# EAGLE schematic system-controller (EAGLE 7.6.0)
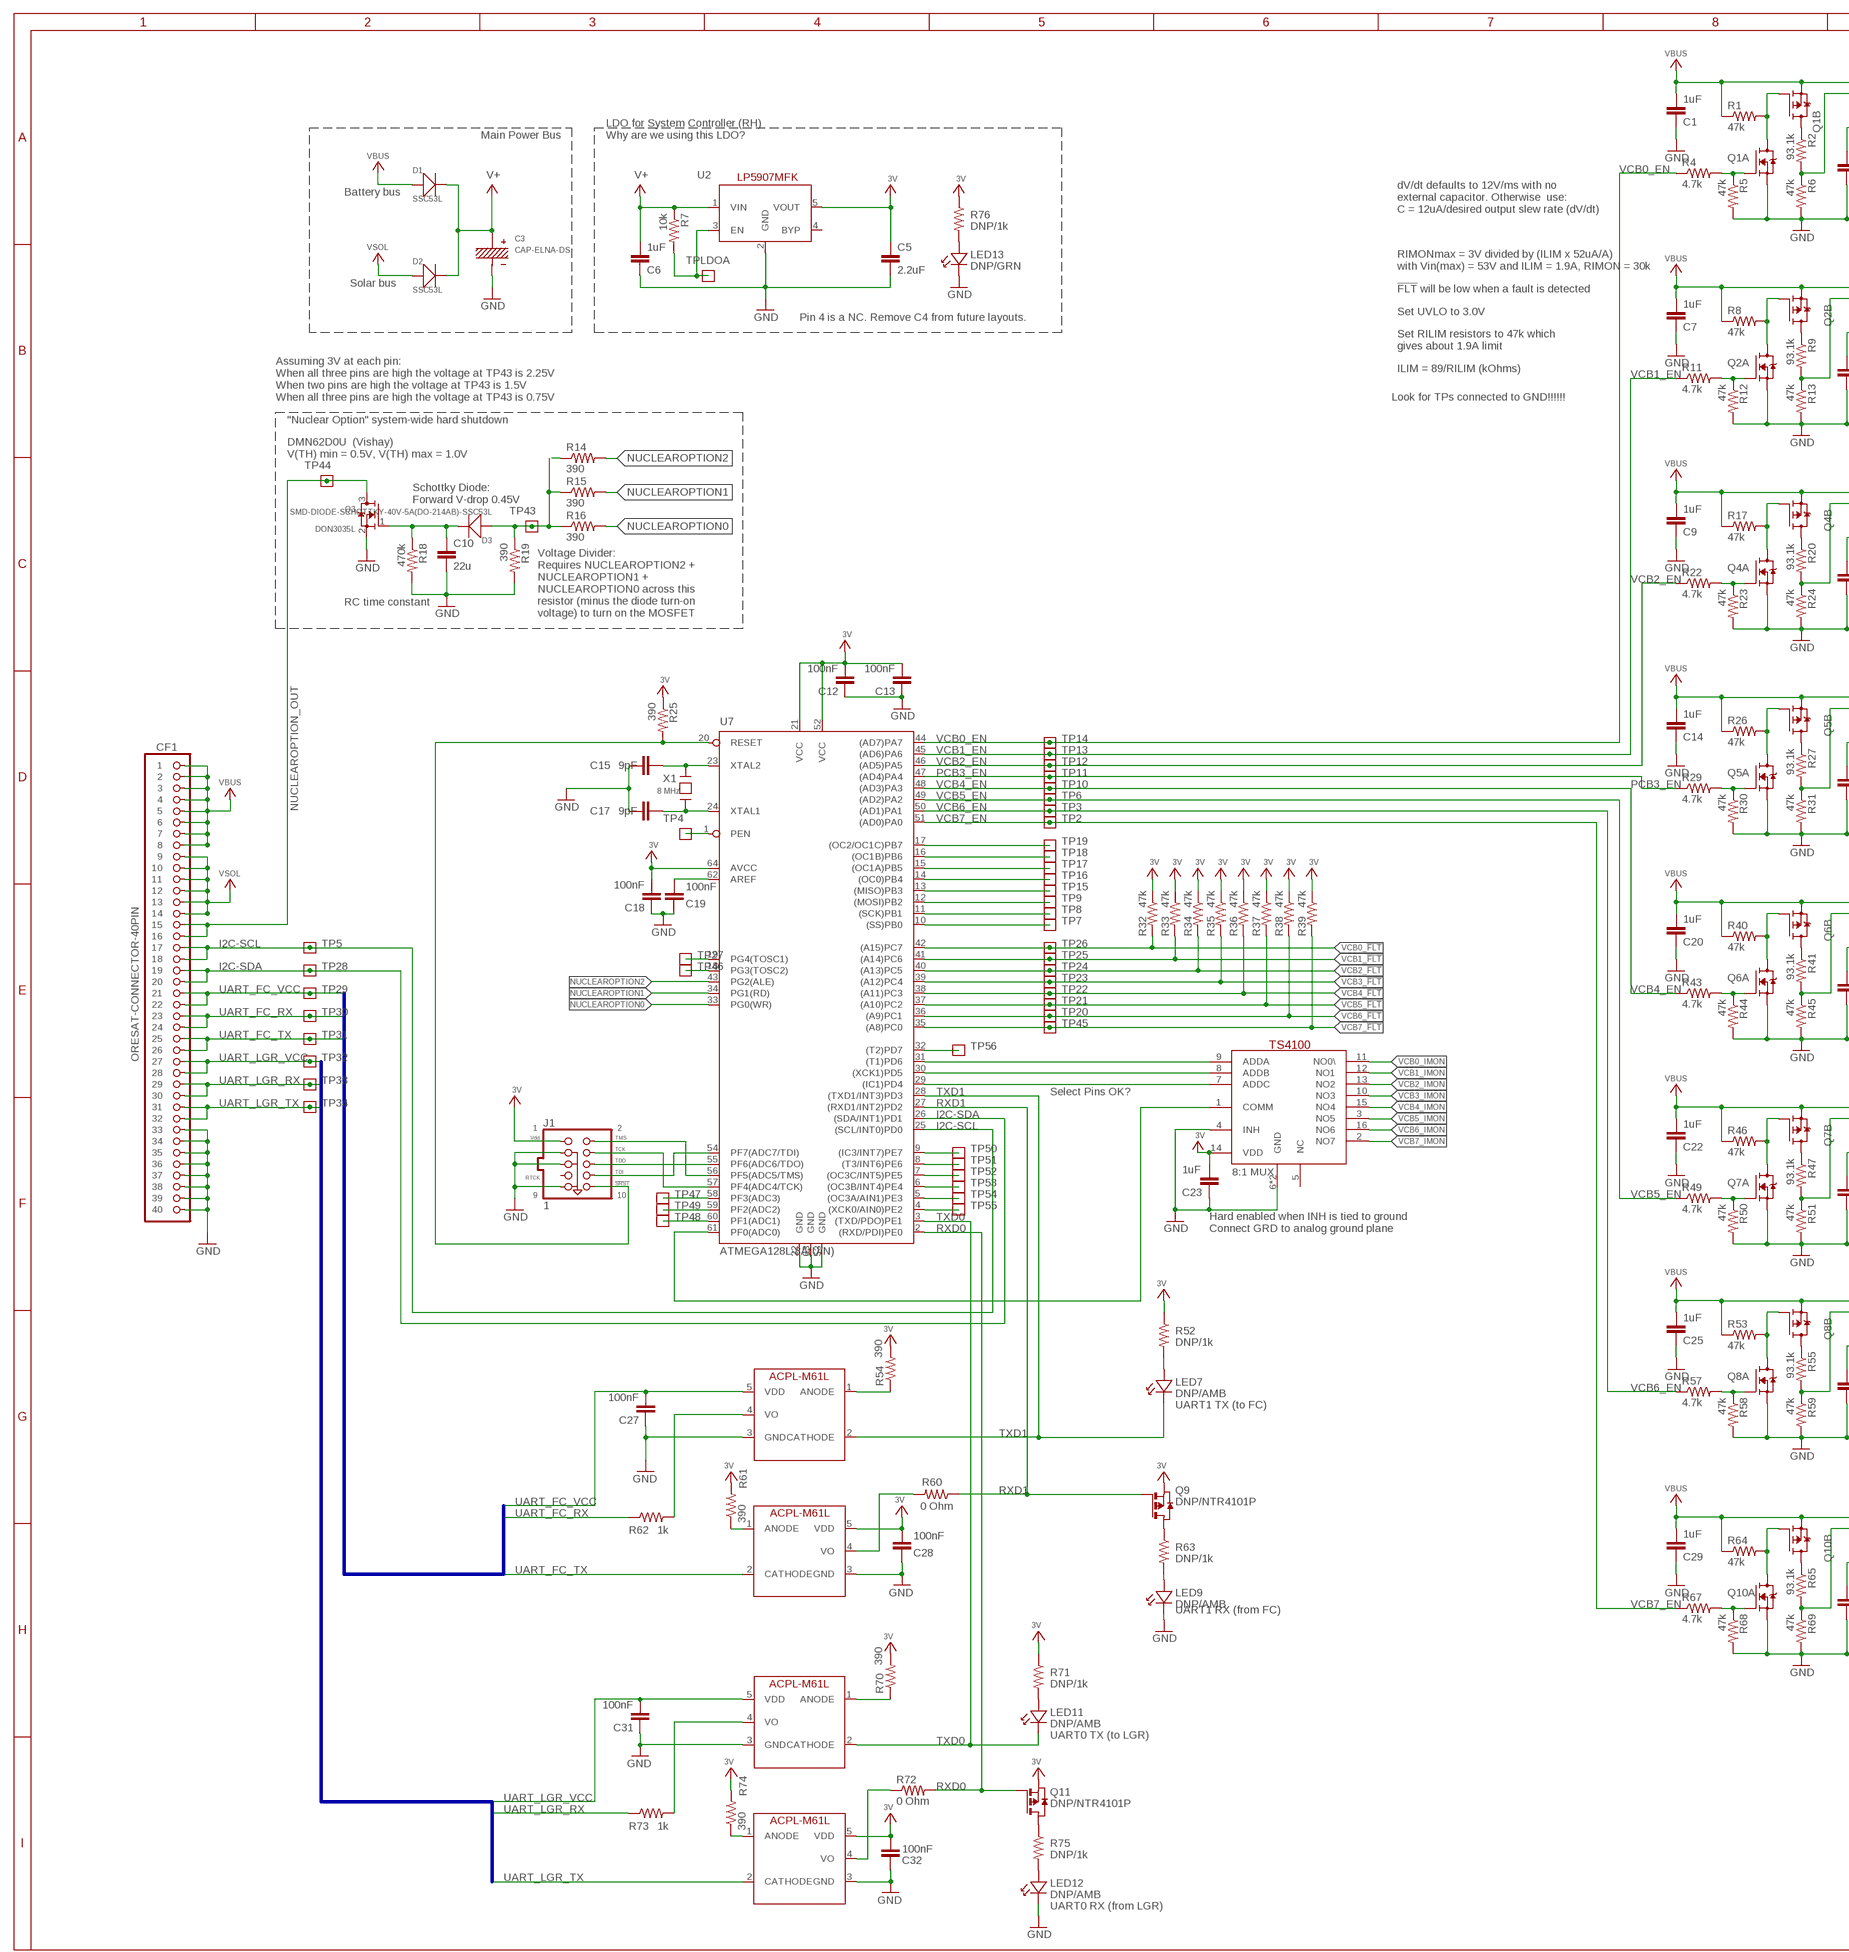
[diagram p0: schematic, sheet 1, part 1 of 2]
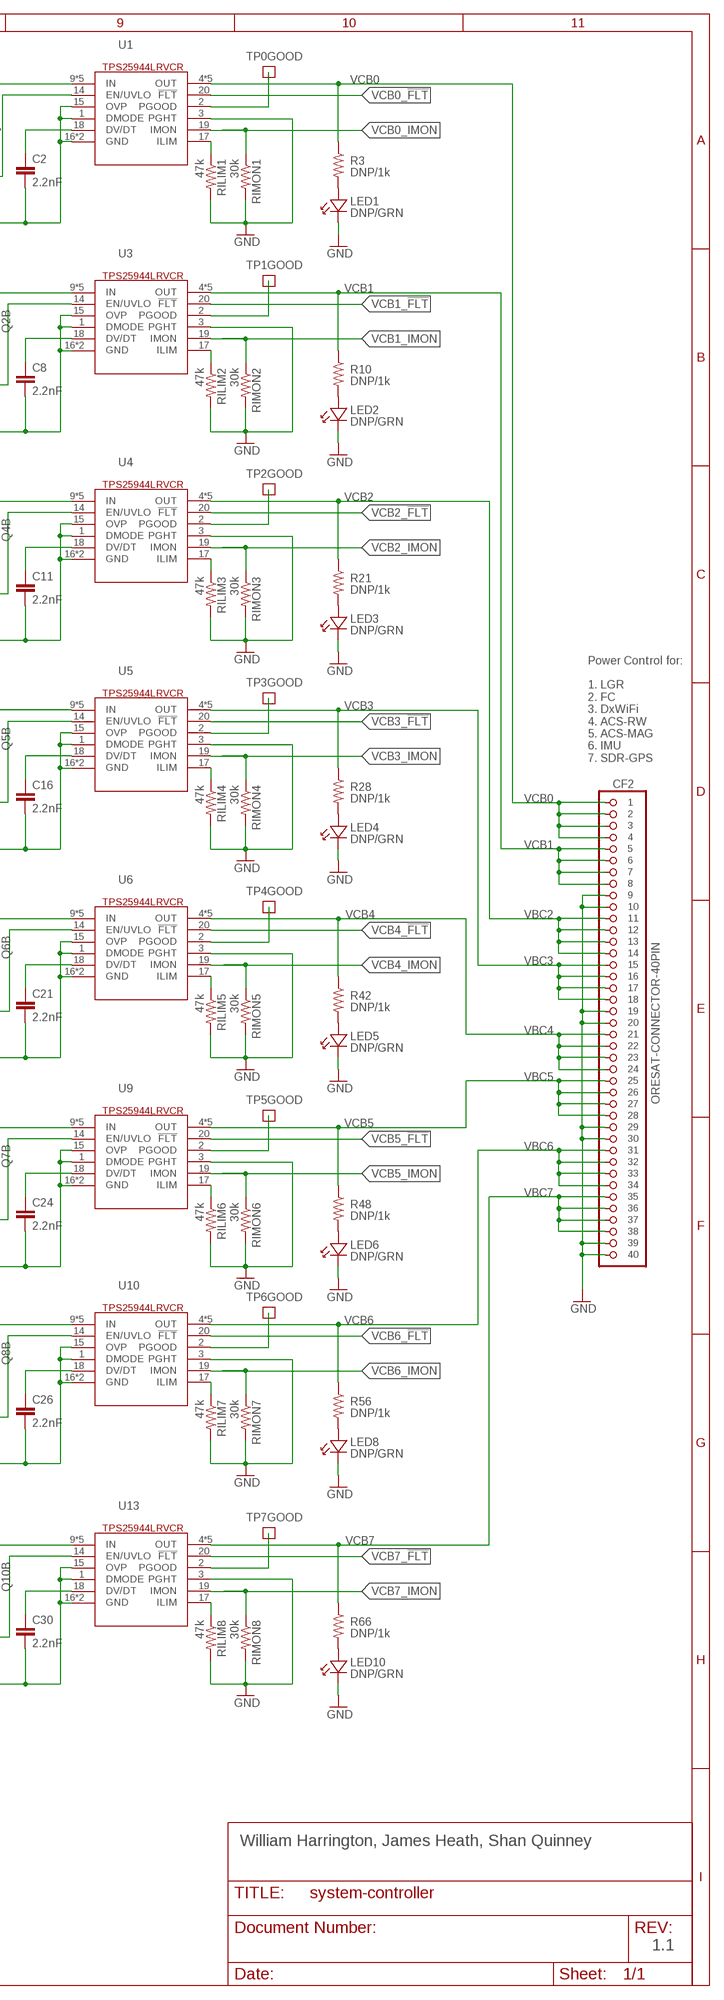
[diagram p1: schematic, sheet 1, part 2 of 2]

## Parts
C1  1uF  C-EU0603-B-NOSILK  [.0603-B-NOSILK]
C2  2.2nF  C-EU0603-B-NOSILK  [.0603-B-NOSILK]
C3  CAP-ELNA-DS  [CAP-ELNA-DS-SERIES]
C5  2.2uF  C-EU0603-B-NOSILK  [.0603-B-NOSILK]
C6  1uF  C-EU0603-B-NOSILK  [.0603-B-NOSILK]
C7  1uF  C-EU0603-B-NOSILK  [.0603-B-NOSILK]
C8  2.2nF  C-EU0603-B-NOSILK  [.0603-B-NOSILK]
C9  1uF  C-EU0603-B-NOSILK  [.0603-B-NOSILK]
C10  22u  C-EU0603-B-NOSILK  [.0603-B-NOSILK]
C11  2.2nF  C-EU0603-B-NOSILK  [.0603-B-NOSILK]
C12  100nF  C-EU0603-B-NOSILK  [.0603-B-NOSILK]
C13  100nF  C-EU0603-B-NOSILK  [.0603-B-NOSILK]
C14  1uF  C-EU0603-B-NOSILK  [.0603-B-NOSILK]
C15  9pF  C-EU0603-B-NOSILK  [.0603-B-NOSILK]
C16  2.2nF  C-EU0603-B-NOSILK  [.0603-B-NOSILK]
C17  9pF  C-EU0603-B-NOSILK  [.0603-B-NOSILK]
C18  100nF  C-EU0603-B-NOSILK  [.0603-B-NOSILK]
C19  100nF  C-EU0603-B-NOSILK  [.0603-B-NOSILK]
C20  1uF  C-EU0603-B-NOSILK  [.0603-B-NOSILK]
C21  2.2nF  C-EU0603-B-NOSILK  [.0603-B-NOSILK]
C22  1uF  C-EU0603-B-NOSILK  [.0603-B-NOSILK]
C23  1uF  C-EU0603-B-NOSILK  [.0603-B-NOSILK]
C24  2.2nF  C-EU0603-B-NOSILK  [.0603-B-NOSILK]
C25  1uF  C-EU0603-B-NOSILK  [.0603-B-NOSILK]
C26  2.2nF  C-EU0603-B-NOSILK  [.0603-B-NOSILK]
C27  100nF  C-EU0603-B-NOSILK  [.0603-B-NOSILK]
C28  100nF  C-EU0603-B-NOSILK  [.0603-B-NOSILK]
C29  1uF  C-EU0603-B-NOSILK  [.0603-B-NOSILK]
C30  2.2nF  C-EU0603-B-NOSILK  [.0603-B-NOSILK]
C31  100nF  C-EU0603-B-NOSILK  [.0603-B-NOSILK]
C32  100nF  C-EU0603-B-NOSILK  [.0603-B-NOSILK]
CF1  ORESAT-CONNECTOR-40PIN  [HARWIN-ARCHER-M50-3202045]
CF2  ORESAT-CONNECTOR-40PIN  [HARWIN-ARCHER-M50-3202045]
D1  SSC53L  SMD-DIODE-SCHOTTKY-40V-5A(DO-214AB)-SSC53L  [DO-214AB]
D2  SSC53L  SMD-DIODE-SCHOTTKY-40V-5A(DO-214AB)-SSC53L  [DO-214AB]
D3  SMD-DIODE-SCHOTTKY-40V-5A(DO-214AB)-SSC53L  [DO-214AB]
J1  1  JTAG_ARM-10-50MIL  [PINHEADER-2X5-0.05+POL+SILK]
LED1  DNP/GRN  LED-0603  [LED-0603]
LED2  DNP/GRN  LED-0603  [LED-0603]
LED3  DNP/GRN  LED-0603  [LED-0603]
LED4  DNP/GRN  LED-0603  [LED-0603]
LED5  DNP/GRN  LED-0603  [LED-0603]
LED6  DNP/GRN  LED-0603  [LED-0603]
LED7  DNP/AMB  LED-0603  [LED-0603]
LED8  DNP/GRN  LED-0603  [LED-0603]
LED9  DNP/AMB  LED-0603  [LED-0603]
LED10  DNP/GRN  LED-0603  [LED-0603]
LED11  DNP/AMB  LED-0603  [LED-0603]
LED12  DNP/AMB  LED-0603  [LED-0603]
LED13  DNP/GRN  LED-0603  [LED-0603]
Q1  MOSFET-P-N-PAIR  [SOT23-6]
Q2  MOSFET-P-N-PAIR  [SOT23-6]
Q3  DON3035L  MOSFET-NREFLOW  [SOT23]
Q4  MOSFET-P-N-PAIR  [SOT23-6]
Q5  MOSFET-P-N-PAIR  [SOT23-6]
Q6  MOSFET-P-N-PAIR  [SOT23-6]
Q7  MOSFET-P-N-PAIR  [SOT23-6]
Q8  MOSFET-P-N-PAIR  [SOT23-6]
Q9  DNP/NTR4101P  NTR4101P  [SOT23]
Q10  MOSFET-P-N-PAIR  [SOT23-6]
Q11  DNP/NTR4101P  NTR4101P  [SOT23]
R1  47k  R-US_0603-B-NOSILK  [.0603-B-NOSILK]
R2  93.1k  R-US_0603-B-NOSILK  [.0603-B-NOSILK]
R3  DNP/1k  R-US_0603-B-NOSILK  [.0603-B-NOSILK]
R4  4.7k  R-US_0603-B-NOSILK  [.0603-B-NOSILK]
R5  47k  R-US_0603-B-NOSILK  [.0603-B-NOSILK]
R6  47k  R-US_0603-B-NOSILK  [.0603-B-NOSILK]
R7  10k  R-US_0603-B-NOSILK  [.0603-B-NOSILK]
R8  47k  R-US_0603-B-NOSILK  [.0603-B-NOSILK]
R9  93.1k  R-US_0603-B-NOSILK  [.0603-B-NOSILK]
R10  DNP/1k  R-US_0603-B-NOSILK  [.0603-B-NOSILK]
R11  4.7k  R-US_0603-B-NOSILK  [.0603-B-NOSILK]
R12  47k  R-US_0603-B-NOSILK  [.0603-B-NOSILK]
R13  47k  R-US_0603-B-NOSILK  [.0603-B-NOSILK]
R14  390  R-US_0603-B-NOSILK  [.0603-B-NOSILK]
R15  390  R-US_0603-B-NOSILK  [.0603-B-NOSILK]
R16  390  R-US_0603-B-NOSILK  [.0603-B-NOSILK]
R17  47k  R-US_0603-B-NOSILK  [.0603-B-NOSILK]
R18  470k  R-US_0603-B-NOSILK  [.0603-B-NOSILK]
R19  390  R-US_0603-B-NOSILK  [.0603-B-NOSILK]
R20  93.1k  R-US_0603-B-NOSILK  [.0603-B-NOSILK]
R21  DNP/1k  R-US_0603-B-NOSILK  [.0603-B-NOSILK]
R22  4.7k  R-US_0603-B-NOSILK  [.0603-B-NOSILK]
R23  47k  R-US_0603-B-NOSILK  [.0603-B-NOSILK]
R24  47k  R-US_0603-B-NOSILK  [.0603-B-NOSILK]
R25  390  R-US_0603-B-NOSILK  [.0603-B-NOSILK]
R26  47k  R-US_0603-B-NOSILK  [.0603-B-NOSILK]
R27  93.1k  R-US_0603-B-NOSILK  [.0603-B-NOSILK]
R28  DNP/1k  R-US_0603-B-NOSILK  [.0603-B-NOSILK]
R29  4.7k  R-US_0603-B-NOSILK  [.0603-B-NOSILK]
R30  47k  R-US_0603-B-NOSILK  [.0603-B-NOSILK]
R31  47k  R-US_0603-B-NOSILK  [.0603-B-NOSILK]
R32  47k  R-US_0603-B-NOSILK  [.0603-B-NOSILK]
R33  47k  R-US_0603-B-NOSILK  [.0603-B-NOSILK]
R34  47k  R-US_0603-B-NOSILK  [.0603-B-NOSILK]
R35  47k  R-US_0603-B-NOSILK  [.0603-B-NOSILK]
R36  47k  R-US_0603-B-NOSILK  [.0603-B-NOSILK]
R37  47k  R-US_0603-B-NOSILK  [.0603-B-NOSILK]
R38  47k  R-US_0603-B-NOSILK  [.0603-B-NOSILK]
R39  47k  R-US_0603-B-NOSILK  [.0603-B-NOSILK]
R40  47k  R-US_0603-B-NOSILK  [.0603-B-NOSILK]
R41  93.1k  R-US_0603-B-NOSILK  [.0603-B-NOSILK]
R42  DNP/1k  R-US_0603-B-NOSILK  [.0603-B-NOSILK]
R43  4.7k  R-US_0603-B-NOSILK  [.0603-B-NOSILK]
R44  47k  R-US_0603-B-NOSILK  [.0603-B-NOSILK]
R45  47k  R-US_0603-B-NOSILK  [.0603-B-NOSILK]
R46  47k  R-US_0603-B-NOSILK  [.0603-B-NOSILK]
R47  93.1k  R-US_0603-B-NOSILK  [.0603-B-NOSILK]
R48  DNP/1k  R-US_0603-B-NOSILK  [.0603-B-NOSILK]
R49  4.7k  R-US_0603-B-NOSILK  [.0603-B-NOSILK]
R50  47k  R-US_0603-B-NOSILK  [.0603-B-NOSILK]
R51  47k  R-US_0603-B-NOSILK  [.0603-B-NOSILK]
R52  DNP/1k  R-US_0603-B-NOSILK  [.0603-B-NOSILK]
R53  47k  R-US_0603-B-NOSILK  [.0603-B-NOSILK]
R54  390  R-US_0603-B-NOSILK  [.0603-B-NOSILK]
R55  93.1k  R-US_0603-B-NOSILK  [.0603-B-NOSILK]
R56  DNP/1k  R-US_0603-B-NOSILK  [.0603-B-NOSILK]
R57  4.7k  R-US_0603-B-NOSILK  [.0603-B-NOSILK]
R58  47k  R-US_0603-B-NOSILK  [.0603-B-NOSILK]
R59  47k  R-US_0603-B-NOSILK  [.0603-B-NOSILK]
R60  0 Ohm  R-US_0603-B-NOSILK  [.0603-B-NOSILK]
R61  390  R-US_0603-B-NOSILK  [.0603-B-NOSILK]
R62  1k  R-US_0603-B-NOSILK  [.0603-B-NOSILK]
R63  DNP/1k  R-US_0603-B-NOSILK  [.0603-B-NOSILK]
R64  47k  R-US_0603-B-NOSILK  [.0603-B-NOSILK]
R65  93.1k  R-US_0603-B-NOSILK  [.0603-B-NOSILK]
R66  DNP/1k  R-US_0603-B-NOSILK  [.0603-B-NOSILK]
R67  4.7k  R-US_0603-B-NOSILK  [.0603-B-NOSILK]
R68  47k  R-US_0603-B-NOSILK  [.0603-B-NOSILK]
R69  47k  R-US_0603-B-NOSILK  [.0603-B-NOSILK]
R70  390  R-US_0603-B-NOSILK  [.0603-B-NOSILK]
R71  DNP/1k  R-US_0603-B-NOSILK  [.0603-B-NOSILK]
R72  0 Ohm  R-US_0603-B-NOSILK  [.0603-B-NOSILK]
R73  1k  R-US_0603-B-NOSILK  [.0603-B-NOSILK]
R74  390  R-US_0603-B-NOSILK  [.0603-B-NOSILK]
R75  DNP/1k  R-US_0603-B-NOSILK  [.0603-B-NOSILK]
R76  DNP/1k  R-US_0603-B-NOSILK  [.0603-B-NOSILK]
RILIM1  47k  R-US_0603-B-NOSILK  [.0603-B-NOSILK]
RILIM2  47k  R-US_0603-B-NOSILK  [.0603-B-NOSILK]
RILIM3  47k  R-US_0603-B-NOSILK  [.0603-B-NOSILK]
RILIM4  47k  R-US_0603-B-NOSILK  [.0603-B-NOSILK]
RILIM5  47k  R-US_0603-B-NOSILK  [.0603-B-NOSILK]
RILIM6  47k  R-US_0603-B-NOSILK  [.0603-B-NOSILK]
RILIM7  47k  R-US_0603-B-NOSILK  [.0603-B-NOSILK]
RILIM8  47k  R-US_0603-B-NOSILK  [.0603-B-NOSILK]
RIMON1  30k  R-US_0603-B-NOSILK  [.0603-B-NOSILK]
RIMON2  30k  R-US_0603-B-NOSILK  [.0603-B-NOSILK]
RIMON3  30k  R-US_0603-B-NOSILK  [.0603-B-NOSILK]
RIMON4  30k  R-US_0603-B-NOSILK  [.0603-B-NOSILK]
RIMON5  30k  R-US_0603-B-NOSILK  [.0603-B-NOSILK]
RIMON6  30k  R-US_0603-B-NOSILK  [.0603-B-NOSILK]
RIMON7  30k  R-US_0603-B-NOSILK  [.0603-B-NOSILK]
RIMON8  30k  R-US_0603-B-NOSILK  [.0603-B-NOSILK]
TP0GOOD  TEST-POINT  [2MM-TEST-POINT]
TP1GOOD  TEST-POINT  [2MM-TEST-POINT]
TP2  TEST-POINT  [2MM-TEST-POINT]
TP2GOOD  TEST-POINT  [2MM-TEST-POINT]
TP3  TEST-POINT  [2MM-TEST-POINT]
TP3GOOD  TEST-POINT  [2MM-TEST-POINT]
TP4  TEST-POINT  [2MM-TEST-POINT]
TP4GOOD  TEST-POINT  [2MM-TEST-POINT]
TP5  TEST-POINT  [2MM-TEST-POINT]
TP5GOOD  TEST-POINT  [2MM-TEST-POINT]
TP6  TEST-POINT  [2MM-TEST-POINT]
TP6GOOD  TEST-POINT  [2MM-TEST-POINT]
TP7  TEST-POINT  [2MM-TEST-POINT]
TP7GOOD  TEST-POINT  [2MM-TEST-POINT]
TP8  TEST-POINT  [2MM-TEST-POINT]
TP9  TEST-POINT  [2MM-TEST-POINT]
TP10  TEST-POINT  [2MM-TEST-POINT]
TP11  TEST-POINT  [2MM-TEST-POINT]
TP12  TEST-POINT  [2MM-TEST-POINT]
TP13  TEST-POINT  [2MM-TEST-POINT]
TP14  TEST-POINT  [2MM-TEST-POINT]
TP15  TEST-POINT  [2MM-TEST-POINT]
TP16  TEST-POINT  [2MM-TEST-POINT]
TP17  TEST-POINT  [2MM-TEST-POINT]
TP18  TEST-POINT  [2MM-TEST-POINT]
TP19  TEST-POINT  [2MM-TEST-POINT]
TP20  TEST-POINT  [2MM-TEST-POINT]
TP21  TEST-POINT  [2MM-TEST-POINT]
TP22  TEST-POINT  [2MM-TEST-POINT]
TP23  TEST-POINT  [2MM-TEST-POINT]
TP24  TEST-POINT  [2MM-TEST-POINT]
TP25  TEST-POINT  [2MM-TEST-POINT]
TP26  TEST-POINT  [2MM-TEST-POINT]
TP27  TEST-POINT  [2MM-TEST-POINT]
TP28  TEST-POINT  [2MM-TEST-POINT]
TP29  TEST-POINT  [2MM-TEST-POINT]
TP30  TEST-POINT  [2MM-TEST-POINT]
TP31  TEST-POINT  [2MM-TEST-POINT]
TP32  TEST-POINT  [2MM-TEST-POINT]
TP33  TEST-POINT  [2MM-TEST-POINT]
TP34  TEST-POINT  [2MM-TEST-POINT]
TP43  TEST-POINT  [2MM-TEST-POINT]
TP44  TEST-POINT  [2MM-TEST-POINT]
TP45  TEST-POINT  [2MM-TEST-POINT]
TP46  TEST-POINT  [2MM-TEST-POINT]
TP47  TEST-POINT  [2MM-TEST-POINT]
TP48  TEST-POINT  [2MM-TEST-POINT]
TP49  TEST-POINT  [2MM-TEST-POINT]
TP50  TEST-POINT  [2MM-TEST-POINT]
TP51  TEST-POINT  [2MM-TEST-POINT]
TP52  TEST-POINT  [2MM-TEST-POINT]
TP53  TEST-POINT  [2MM-TEST-POINT]
TP54  TEST-POINT  [2MM-TEST-POINT]
TP55  TEST-POINT  [2MM-TEST-POINT]
TP56  TEST-POINT  [2MM-TEST-POINT]
TPLDOA  TEST-POINT  [2MM-TEST-POINT]
U1  TPS25944LRVCRWQFN-20-3X4  [QFN-20-L]
U2  LP5907MFX-3.0  [SOT-23]
U3  TPS25944LRVCRWQFN-20-3X4  [QFN-20-L]
U4  TPS25944LRVCRWQFN-20-3X4  [QFN-20-L]
U5  TPS25944LRVCRWQFN-20-3X4  [QFN-20-L]
U6  TPS25944LRVCRWQFN-20-3X4  [QFN-20-L]
U7  ATMEGA128L-8A(U/N)  MEGA128-A  [TQFP64]
U8  TS4100  [QFN50P400X400X80-17N]
U9  TPS25944LRVCRWQFN-20-3X4  [QFN-20-L]
U10  TPS25944LRVCRWQFN-20-3X4  [QFN-20-L]
U13  TPS25944LRVCRWQFN-20-3X4  [QFN-20-L]
U$1  ACPL-M61L  [ACPL-M61L]
U$2  ACPL-M61L  [ACPL-M61L]
U$3  ACPL-M61L  [ACPL-M61L]
U$4  ACPL-M61L  [ACPL-M61L]
X1  8 MHz CRYSTAL-ABRACON-ABM3-SMD  CRYSTAL-ABRACON-ABM3-SMD  [CRYSTAL-ABRACON-ABM3-SMD]

## Nets
3V: C5.1 C12.2 C13.2 C18.2 C23.2 C28.2 C32.2 J1.1(VDD) Q9.2(S) Q11.2(S) R25.1 R32.1 R33.1 R34.1 R35.1 R36.1 R37.1 R38.1 R39.1 R52.1 R54.2 R61.2 R70.2 R71.1 R74.2 R76.1 U2.5(VOUT) U7.21(VCC) U7.52(VCC) U7.64(AVCC) U8.14(VDD) U$3.5(VDD) U$4.5(VDD)
AREF: C19.2 U7.62(AREF)
GND: C1.1 C2.2 C3.- C5.2 C6.1 C7.1 C8.2 C9.1 C10.2 C11.2 C12.1 C13.1 C14.1 C15.1 C16.2 C17.1 C18.1 C19.1 C20.1 C21.2 C22.1 C23.1 C24.2 C25.1 C26.2 C27.1 C28.1 C29.1 C30.2 C31.1 C32.1 CF1.P$33 CF1.P$34 CF1.P$35 CF1.P$36 CF1.P$37 CF1.P$38 CF1.P$39 CF1.P$40 CF2.P$9 CF2.P$10 CF2.P$19 CF2.P$20 CF2.P$29 CF2.P$30 CF2.P$39 CF2.P$40 J1.3(GND3) J1.5(GND5) J1.9(GND9) LED1.K LED2.K LED3.K LED4.K LED5.K LED6.K LED8.K LED9.K LED10.K LED12.K LED13.K Q1.5(A:S) Q2.5(A:S) Q3.2(S) Q4.5(A:S) Q5.5(A:S) Q6.5(A:S) Q7.5(A:S) Q8.5(A:S) Q10.5(A:S) R5.2 R6.2 R12.2 R13.2 R18.2 R19.2 R23.2 R24.2 R30.2 R31.2 R44.2 R45.2 R50.2 R51.2 R58.2 R59.2 R68.2 R69.2 RILIM1.2 RILIM2.2 RILIM3.2 RILIM4.2 RILIM5.2 RILIM6.2 RILIM7.2 RILIM8.2 RIMON1.2 RIMON2.2 RIMON3.2 RIMON4.2 RIMON5.2 RIMON6.2 RIMON7.2 RIMON8.2 U1.1(DMODE) U1.3(PGHT) U1.15(OVP) U1.16(GND) U1.21(GND) U2.2(GND) U3.1(DMODE) U3.3(PGHT) U3.15(OVP) U3.16(GND) U3.21(GND) U4.1(DMODE) U4.3(PGHT) U4.15(OVP) U4.16(GND) U4.21(GND) U5.1(DMODE) U5.3(PGHT) U5.15(OVP) U5.16(GND) U5.21(GND) U6.1(DMODE) U6.3(PGHT) U6.15(OVP) U6.16(GND) U6.21(GND) U7.22(GND) U7.53(GND) U7.63(GND) U8.4(INH) U8.6(GND) U8.17(GND) U9.1(DMODE) U9.3(PGHT) U9.15(OVP) U9.16(GND) U9.21(GND) U10.1(DMODE) U10.3(PGHT) U10.15(OVP) U10.16(GND) U10.21(GND) U13.1(DMODE) U13.3(PGHT) U13.15(OVP) U13.16(GND) U13.21(GND) U$1.3(GND) U$2.3(GND) U$3.3(GND) U$4.3(GND)
I2C-SCL: CF1.P$17 CF1.P$18 TP5.1 U7.25((SCL/INT0)PD0)
I2C-SDA: CF1.P$19 CF1.P$20 TP28.1 U7.26((SDA/INT1)PD1)
INOF: C2.1 U1.18(DV/DT)
N$1: C17.2 U7.24(XTAL1) X1.P$2
N$2: Q2.4(B:D) R9.1
N$4: R70.1 U$2.1(ANODE)
N$5: R62.2 U$1.4(VO)
N$6: LED13.A R76.2
N$8: R61.1 U$3.1(ANODE)
N$9: R2.2 R6.1 U1.14(EN/UVLO)
N$10: R20.2 R24.1 U4.14(EN/UVLO)
N$11: J1.4(TCK) U7.57(PF4(ADC4/TCK))
N$12: J1.6(TDO) U7.55(PF6(ADC6/TDO))
N$13: J1.8(TDI) U7.54(PF7(ADC7/TDI))
N$14: J1.2(TMS) U7.56(PF5(ADC5/TMS))
N$15: J1.10(SRST) R25.2 U7.20(RESET)
N$16: R73.2 U$2.4(VO)
N$17: C15.2 U7.23(XTAL2) X1.P$1
N$18: R72.1 U$4.4(VO)
N$19: RILIM3.1 U4.17(ILIM)
N$21: RILIM1.1 U1.17(ILIM)
N$22: R7.2 TPLDOA.1 U2.3(EN)
N$24: R60.2 U$3.4(VO)
N$25: TP0GOOD.1 U1.2(PGOOD)
N$26: LED1.A R3.2
N$27: TP46.1 U7.18(PG3(TOSC2))
N$28: TP27.1 U7.19(PG4(TOSC1))
N$29: R9.2 R13.1 U3.14(EN/UVLO)
N$30: RILIM2.1 U3.17(ILIM)
N$32: TP1GOOD.1 U3.2(PGOOD)
N$33: TP4.1 U7.1(PEN)
N$34: TP47.1 U7.58(PF3(ADC3))
N$35: TP49.1 U7.59(PF2(ADC2))
N$37: TP48.1 U7.60(PF1(ADC1))
N$38: C8.1 U3.18(DV/DT)
N$39: TP55.1 U7.4((XCK0/AIN0)PE2)
N$40: TP54.1 U7.5((OC3A/AIN1)PE3)
N$41: TP53.1 U7.6((OC3B/INT4)PE4)
N$42: TP52.1 U7.7((OC3C/INT5)PE5)
N$43: TP51.1 U7.8((T3/INT6)PE6)
N$44: TP50.1 U7.9((IC3/INT7)PE7)
N$45: LED2.A R10.2
N$46: U7.29((IC1)PD4) U8.7(ADDC)
N$47: U7.30((XCK1)PD5) U8.8(ADDB)
N$48: U7.31((T1)PD6) U8.9(ADDA)
N$49: Q2.1(A:G) R11.2 R12.1
N$50: Q1.1(A:G) R4.2 R5.1
N$51: Q2.3(B:G) Q2.6(A:D) R8.2
N$52: LED3.A R21.2
N$53: LED12.A R75.2
N$54: R74.1 U$4.1(ANODE)
N$55: Q11.3(D) R75.1
N$56: LED7.A R52.2
N$57: LED11.A R71.2
N$58: R54.1 U$1.1(ANODE)
N$59: TP2GOOD.1 U4.2(PGOOD)
N$60: LED9.A R63.2
N$61: Q9.3(D) R63.1
N$62: C11.1 U4.18(DV/DT)
N$63: Q4.1(A:G) R22.2 R23.1
N$64: Q4.4(B:D) R20.1
N$65: Q4.3(B:G) Q4.6(A:D) R17.2
N$66: LED4.A R28.2
N$67: R65.2 R69.1 U13.14(EN/UVLO)
N$68: RILIM8.1 U13.17(ILIM)
N$69: TP7GOOD.1 U13.2(PGOOD)
N$70: C30.1 U13.18(DV/DT)
N$71: Q10.1(A:G) R67.2 R68.1
N$72: Q1.3(B:G) Q1.6(A:D) R1.2
N$73: Q10.3(B:G) Q10.6(A:D) R64.2
N$74: LED5.A R42.2
N$75: R47.2 R51.1 U9.14(EN/UVLO)
N$76: RILIM6.1 U9.17(ILIM)
N$77: TP5GOOD.1 U9.2(PGOOD)
N$78: C24.1 U9.18(DV/DT)
N$79: Q7.1(A:G) R49.2 R50.1
N$80: Q1.4(B:D) R2.1
N$81: Q7.3(B:G) Q7.6(A:D) R46.2
N$82: LED6.A R48.2
N$83: R41.2 R45.1 U6.14(EN/UVLO)
N$84: RILIM5.1 U6.17(ILIM)
N$85: TP4GOOD.1 U6.2(PGOOD)
N$86: C21.1 U6.18(DV/DT)
N$87: Q6.1(A:G) R43.2 R44.1
N$88: Q5.4(B:D) R27.1
N$89: Q6.3(B:G) Q6.6(A:D) R40.2
N$90: LED8.A R56.2
N$91: R27.2 R31.1 U5.14(EN/UVLO)
N$92: RILIM4.1 U5.17(ILIM)
N$93: TP3GOOD.1 U5.2(PGOOD)
N$94: C16.1 U5.18(DV/DT)
N$95: Q5.1(A:G) R29.2 R30.1
N$96: Q6.4(B:D) R41.1
N$97: Q5.3(B:G) Q5.6(A:D) R26.2
N$98: LED10.A R66.2
N$99: R55.2 R59.1 U10.14(EN/UVLO)
N$100: RILIM7.1 U10.17(ILIM)
N$101: TP6GOOD.1 U10.2(PGOOD)
N$102: C26.1 U10.18(DV/DT)
N$103: Q8.1(A:G) R57.2 R58.1
N$104: TP56.1 U7.32((T2)PD7)
N$105: Q8.3(B:G) Q8.6(A:D) R53.2
N$106: C10.1 D3.2(-) Q3.1(G) R18.1
N$107: U7.61(PF0(ADC0)) U8.1(COMM)
N$108: Q7.4(B:D) R47.1
N$109: D3.1(+) R14.1 R15.1 R16.1 R19.1 TP43.1
N$110: Q10.4(B:D) R65.1
N$111: Q8.4(B:D) R55.1
NUCLEAROPTION0: R16.2 U7.33(PG0(WR))
NUCLEAROPTION1: R15.2 U7.34(PG1(RD))
NUCLEAROPTION2: R14.2 U7.43(PG2(ALE))
NUCLEAROPTION_OUT: CF1.P$15 CF1.P$16 Q3.3(D) TP44.1
PB0: TP7.1 U7.10((SS)PB0)
PB1: TP8.1 U7.11((SCK)PB1)
PB2: TP9.1 U7.12((MOSI)PB2)
PB3: TP15.1 U7.13((MISO)PB3)
PB4: TP16.1 U7.14((OC0)PB4)
PB5: TP17.1 U7.15((OC1A)PB5)
PB6: TP18.1 U7.16((OC1B)PB6)
PB7: TP19.1 U7.17((OC2/OC1C)PB7)
PCB3_EN: R29.1 TP11.1 U7.47((AD4)PA4)
RXD0: Q11.1(G) R72.2 U7.2((RXD/PDI)PE0)
RXD1: Q9.1(G) R60.1 U7.27((RXD1/INT2)PD2)
TXD0: LED11.K U7.3((TXD/PDO)PE1) U$2.2(CATHODE)
TXD1: LED7.K U7.28((TXD1/INT3)PD3) U$1.2(CATHODE)
UART_FC_RX: CF1.P$23 CF1.P$24 R62.1 TP30.1
UART_FC_TX: CF1.P$25 CF1.P$26 TP31.1 U$3.2(CATHODE)
UART_FC_VCC: C27.2 CF1.P$21 CF1.P$22 TP29.1 U$1.5(VDD)
UART_LGR_RX: CF1.P$29 CF1.P$30 R73.1 TP33.1
UART_LGR_TX: CF1.P$31 CF1.P$32 TP34.1 U$4.2(CATHODE)
UART_LGR_VCC: C31.2 CF1.P$27 CF1.P$28 TP32.1 U$2.5(VDD)
V+: C3.+ C6.2 D1.2(-) D2.2(-) R7.1 U2.1(VIN)
VBUS: C1.2 C7.2 C9.2 C14.2 C20.2 C22.2 C25.2 C29.2 CF1.P$1 CF1.P$2 CF1.P$3 CF1.P$4 CF1.P$5 CF1.P$6 CF1.P$7 CF1.P$8 D1.1(+) Q1.2(B:S) Q2.2(B:S) Q4.2(B:S) Q5.2(B:S) Q6.2(B:S) Q7.2(B:S) Q8.2(B:S) Q10.2(B:S) R1.1 R8.1 R17.1 R26.1 R40.1 R46.1 R53.1 R64.1 U1.9(IN) U1.10(IN) U1.11(IN) U1.12(IN) U1.13(IN) U3.9(IN) U3.10(IN) U3.11(IN) U3.12(IN) U3.13(IN) U4.9(IN) U4.10(IN) U4.11(IN) U4.12(IN) U4.13(IN) U5.9(IN) U5.10(IN) U5.11(IN) U5.12(IN) U5.13(IN) U6.9(IN) U6.10(IN) U6.11(IN) U6.12(IN) U6.13(IN) U9.9(IN) U9.10(IN) U9.11(IN) U9.12(IN) U9.13(IN) U10.9(IN) U10.10(IN) U10.11(IN) U10.12(IN) U10.13(IN) U13.9(IN) U13.10(IN) U13.11(IN) U13.12(IN) U13.13(IN)
VCB0: CF2.P$1 CF2.P$2 CF2.P$3 CF2.P$4 R3.1 U1.4(OUT) U1.5(OUT) U1.6(OUT) U1.7(OUT) U1.8(OUT)
VCB0_!FLT: R32.2 TP26.1 U1.20(!FLT) U7.42((A15)PC7)
VCB0_EN: R4.1 TP14.1 U7.44((AD7)PA7)
VCB0_IMON: RIMON1.1 U1.19(IMON) U8.11(NO0\)
VCB1: CF2.P$5 CF2.P$6 CF2.P$7 CF2.P$8 R10.1 U3.4(OUT) U3.5(OUT) U3.6(OUT) U3.7(OUT) U3.8(OUT)
VCB1_!FLT: R33.2 TP25.1 U3.20(!FLT) U7.41((A14)PC6)
VCB1_EN: R11.1 TP13.1 U7.45((AD6)PA6)
VCB1_IMON: RIMON2.1 U3.19(IMON) U8.12(NO1)
VCB2: CF2.P$11 CF2.P$12 CF2.P$13 CF2.P$14 R21.1 U4.4(OUT) U4.5(OUT) U4.6(OUT) U4.7(OUT) U4.8(OUT)
VCB2_!FLT: R34.2 TP24.1 U4.20(!FLT) U7.40((A13)PC5)
VCB2_EN: R22.1 TP12.1 U7.46((AD5)PA5)
VCB2_IMON: RIMON3.1 U4.19(IMON) U8.13(NO2)
VCB3: CF2.P$15 CF2.P$16 CF2.P$17 CF2.P$18 R28.1 U5.4(OUT) U5.5(OUT) U5.6(OUT) U5.7(OUT) U5.8(OUT)
VCB3_!FLT: R35.2 TP23.1 U5.20(!FLT) U7.39((A12)PC4)
VCB3_IMON: RIMON4.1 U5.19(IMON) U8.10(NO3)
VCB4: CF2.P$21 CF2.P$22 CF2.P$23 CF2.P$24 R42.1 U6.4(OUT) U6.5(OUT) U6.6(OUT) U6.7(OUT) U6.8(OUT)
VCB4_!FLT: R36.2 TP22.1 U6.20(!FLT) U7.38((A11)PC3)
VCB4_EN: R43.1 TP10.1 U7.48((AD3)PA3)
VCB4_IMON: RIMON5.1 U6.19(IMON) U8.15(NO4)
VCB5: CF2.P$25 CF2.P$26 CF2.P$27 CF2.P$28 R48.1 U9.4(OUT) U9.5(OUT) U9.6(OUT) U9.7(OUT) U9.8(OUT)
VCB5_!FLT: R37.2 TP21.1 U7.37((A10)PC2) U9.20(!FLT)
VCB5_EN: R49.1 TP6.1 U7.49((AD2)PA2)
VCB5_IMON: RIMON6.1 U8.3(NO5) U9.19(IMON)
VCB6: CF2.P$31 CF2.P$32 CF2.P$33 CF2.P$34 R56.1 U10.4(OUT) U10.5(OUT) U10.6(OUT) U10.7(OUT) U10.8(OUT)
VCB6_!FLT: R38.2 TP20.1 U7.36((A9)PC1) U10.20(!FLT)
VCB6_EN: R57.1 TP3.1 U7.50((AD1)PA1)
VCB6_IMON: RIMON7.1 U8.16(NO6) U10.19(IMON)
VCB7: CF2.P$35 CF2.P$36 CF2.P$37 CF2.P$38 R66.1 U13.4(OUT) U13.5(OUT) U13.6(OUT) U13.7(OUT) U13.8(OUT)
VCB7_!FLT: R39.2 TP45.1 U7.35((A8)PC0) U13.20(!FLT)
VCB7_EN: R67.1 TP2.1 U7.51((AD0)PA0)
VCB7_IMON: RIMON8.1 U8.2(NO7) U13.19(IMON)
VSOL: CF1.P$9 CF1.P$10 CF1.P$11 CF1.P$12 CF1.P$13 CF1.P$14 D2.1(+)
Unconnected: J1.7(RTCK) U2.4(BYP) U8.5(NC)

## Buses
UART_LGR_VCC,UART_LGR_RX,UART_LGR_TX
UART_FC_VCC,UART_FC_RX,UART_FC_TX

## Notes on the sheet
- Main Power Bus
- LDO for System Controller (RH)
  Why are we using this LDO?
- Battery bus
- dV/dt defaults to 12V/ms with no
  external capacitor. Otherwise  use:
  C = 12uA/desired output slew rate (dV/dt)
- RIMONmax = 3V divided by (ILIM x 52uA/A)
  with Vin(max) = 53V and ILIM = 1.9A, RIMON = 30k
- Solar bus
- !FLT! will be low when a fault is detected
- Set UVLO to 3.0V
- Pin 4 is a NC. Remove C4 from future layouts.
- Set RILIM resistors to 47k which
  gives about 1.9A limit
- ILIM = 89/RILIM (kOhms)
- Assuming 3V at each pin:
  When all three pins are high the voltage at TP43 is 2.25V
  When two pins are high the voltage at TP43 is 1.5V
  When all three pins are high the voltage at TP43 is 0.75V
- Look for TPs connected to GND!!!!!!
- "Nuclear Option" system-wide hard shutdown
- DMN62D0U  (Vishay)
  V(TH) min = 0.5V, V(TH) max = 1.0V
- Schottky Diode:
  Forward V-drop 0.45V
- RH
- RH
- RC time constant
- Voltage Divider:
  Requires NUCLEAROPTION2 +
  NUCLEAROPTION1 +
  NUCLEAROPTION0 across this 
  resistor (minus the diode turn-on
  voltage) to turn on the MOSFET
- Power Control for:
  
  1. LGR
  2. FC
  3. DxWiFi
  4. ACS-RW
  5. ACS-MAG
  6. IMU
  7. SDR-GPS
- 8 MHz
- VBC2
- VBC3
- VBC4
- VBC5
- Select Pins OK?
- VBC6
- VBC7
- Hard enabled when INH is tied to ground
  Connect GRD to analog ground plane
- UART1 TX (to FC)
- UART1 RX (from FC)
- UART0 TX (to LGR)
- William Harrington, James Heath, Shan Quinney
- UART0 RX (from LGR)
- 1.1

## Library data of the parts
C1 C6 C7 C9 C14 C20 C22 C23 C25 C29 = rcl_custom:C-EU: CAPACITOR, European symbol; DIST: digikey; DPN: 1276-1946-1-ND; MFN: Samsung; MPN: CL10B105KP8NNNC
C2 C8 C11 C16 C21 C24 C26 C30 = rcl_custom:C-EU: CAPACITOR, European symbol; DIST: digikey; DPN: 1276-2239-1-ND; MFN: Samsung; MPN: CL10C222GA8NNNC
C3 = cap-elna-ds:CAP-ELNA-DS; DIST: digikey; DPN: 604-1020-1-ND; MFN: Elna America; MPN: DSK-3R3H224U-HL
C5 = rcl_custom:C-EU: CAPACITOR, European symbol; DIST: digikey; DPN: 1276-1183-1-ND; MFN: Samsung; MPN: CL10A225KQ8NNNC
C10 = rcl_custom:C-EU: CAPACITOR, European symbol; DIST: digikey; DPN: 399-1092-1-ND; MFN: Kemet; MPN: C0603C103J5RACTU
C12 C13 C18 C19 C27 C28 = rcl_custom:C-EU: CAPACITOR, European symbol; DIST: digikey; DPN: 399-1097-1-ND; MFN: Kemet; MPN: C0603C104J4RACTU
C15 C17 = rcl_custom:C-EU: CAPACITOR, European symbol; DIST: digikey; DPN: 399-11245-1-ND; MFN: Kemet; MPN: CBR02C909B5GAC
C31 C32 = rcl_custom:C-EU: CAPACITOR, European symbol; DIST: digikey; DPN: 490-6327-1-ND; MFN: Murata; MPN: GRM155R71C104JA88D
CF1 CF2 = oresat-eagle:ORESAT-CONNECTOR-40PIN: OreSat 40pin card connector. Uses the Harwin Archer M50-3202045.; DIST: digikey; DPN: 952-1381-5-ND; MFN: Harwin Inc.; MPN: M50-3202045
D1-D3 = system-controller:SMD-DIODE-SCHOTTKY-40V-5A(DO-214AB)-SSC53L: SSC53L 5A, .45V Turn on; DIST: digikey; DPN: SSC53L-E3/57TGICT-ND; MFN: Vishay; MPN: SSC53L-E3/57T
J1 = psas_c3_team05:JTAG_ARM-10-*: JTAG PIN HEADER 2x5 This is one of the (smaller) ARM standard JTAG connectors.; DIST: digikey; DPN: 3220-10-0100-99-ND; MFN: CNC Tech; MPN: 3220-10-0100-00
LED1-LED6 LED8 LED10 LED13 = psas_c3_team05:LED: Generic LED with Color designator as an attribute.; DIST: digikey; DPN: 732-4971-1-ND; MFN: Wurth Electronics INC.; MPN: 150060GS75000
LED7 LED9 LED11 LED12 = psas_c3_team05:LED: Generic LED with Color designator as an attribute.; DIST: digikey; DPN: 475-2712-1-ND; MFN: OSRAM Opto Semi,; MPN: LA L296-Q2R2-1-Z
Q1 Q2 Q4-Q8 Q10 = ic-transistor-mosfet-n-p:MOSFET-P-N-PAIR; DIST: digikey; DPN: DMG6601LVT-7DICT-ND; MFN: Diodes Incorporated; MPN: DMG6601LVT-7
Q3 = adafruit:MOSFET-N: N-Channel Mosfet 2N7002E - 60V 260mA SOT23 [Digikey: 2N7002ET1GOSTR-ND] - REEL BSH103 - 30V 850mA SOT23 [Digikey: 568-5013-1-ND]; DIST: digikey; DPN: DMN62D0U-13DICT-ND; MFN: Diodes Inc.; MPN: DMN62D0U-13
Q9 Q11 = Tova:NTR4101P; DIST: digikey; DPN: NTR4101PT1HOSCT-ND; MFN: ON Semiconductor; MPN: NTR4101PT1H
R1 R5 R6 R8 R12 R13 R17 R23 R24 R26 R30-R40 R44-R46 R50 R51 R53 R58 R59 R64 R68 R69 RILIM1-RILIM8 = rcl_custom:R-US_: RESISTOR, American symbol; DIST: digikey; DPN: 1276-4808-1-ND; MFN: Samaung; MPN: RC1608F473CS
R2 R9 R20 R27 R41 R47 R55 R65 = rcl_custom:R-US_: RESISTOR, American symbol; DIST: digikey; DPN: 1276-4837-1-ND; MFN: Samsung; MPN: RC1608F9312CS
R3 R10 R21 R28 R42 R48 R52 R56 R63 R66 R71 R75 R76 = rcl_custom:R-US_: RESISTOR, American symbol; DIST: digikey; DPN: 1276-3484-1-ND; MFN: Samsung; MPN: RC1608F102CS
R4 R11 R22 R29 R43 R49 R57 R67 = rcl_custom:R-US_: RESISTOR, American symbol; DIST: digikey; DPN: 1276-3502-1-ND; MFN: Samsung; MPN: RC1608F472CS
R7 = rcl_custom:R-US_: RESISTOR, American symbol; DIST: digikey; DPN: 1276-3485-1-ND; MFN: Samsung; MPN: RC1608F103CS
R14-R16 R19 R25 R54 R60-R62 R70 R72-R74 = rcl_custom:R-US_: RESISTOR, American symbol; DIST: digikey; DPN: A103093CT-ND; MFN: TE; MPN: 4-1676481-5
R18 = rcl_custom:R-US_: RESISTOR, American symbol; DIST: digikey; DPN: 1276-4902-1-ND; MFN: Samsung; MPN: RC1608F474CS
RIMON1-RIMON8 = rcl_custom:R-US_: RESISTOR, American symbol; DIST: digikey; DPN: 1276-4787-1-ND; MFN: Samsung; MPN: RC1608F3012CS
TP0GOOD TP1GOOD TP2 TP2GOOD TP3 TP3GOOD TP4 TP4GOOD TP5 TP5GOOD TP6 TP6GOOD TP7 TP7GOOD TP8-TP34 TP43-TP56 TPLDOA = Tova:TEST-POINT
U1 U3-U6 U9 U10 U13 = system-controller:TPS25944LRVCR; DIST: digikey; DPN: 296-42152-1-ND; MFN: Texas Instruments; MPN: TPS25944LRVCR
U2 = system-controller:LP5907MFX-3.0; DIST: digikey; DPN: 296-40357-1-ND; MFN: Texas Inst.; MPN: LP5907MFX-3.0/NOPB
U7 = atmegas128:MEGA128: MICROCONTROLLER 128 Kbytes FLASH 4 Kbytes SRAM 4 Kbytes EEPROM DUAL USART 8-channel 10 bit ADC Source: avr.lbr; MFN: Atmel; MPN: ATMEGA128-16AU; OC_FARNELL: 9171118; OC_NEWARK: 95K7364
U8 = system-controller:TS4100; DIST: digikey; DPN: 336-3600-ND; MFN: Silicon Labs; MPN: TS4100ITQ1633
U$1-U$4 = system-controller:ACPL-M61L
X1 = crystal-abracon-abm3-smd:CRYSTAL-ABRACON-ABM3-SMD: Abracon ABM3-8.000MHz-D2Y-T; DIST: digikey; DPN: 535-10630-1-ND; MFN: ABM3-8.000MHZ-D2Y-T; MPN: Abracon LLC